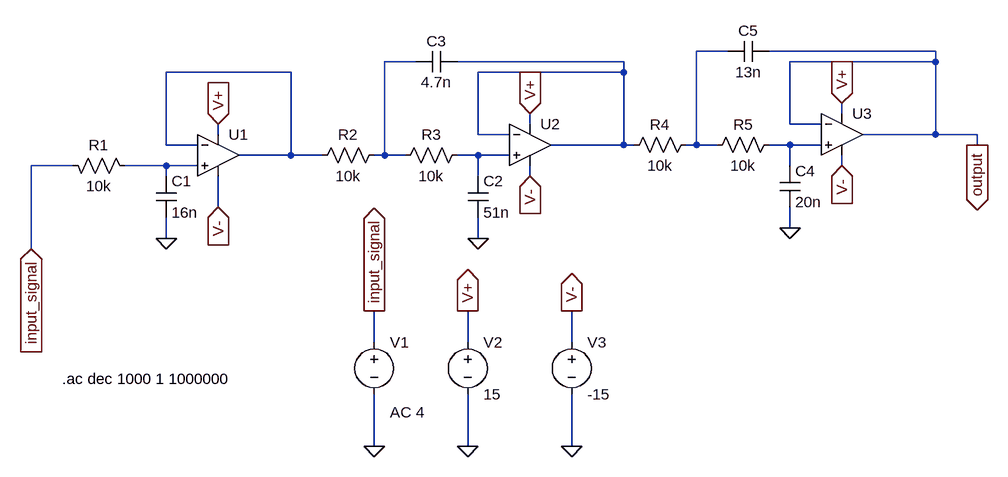
[diagram p0: schematic simulation.asc]
simulation.asc, the LTspice schematic file:
Version 4.1
SHEET 1 1496 680
WIRE 1040 -16 992 -16
WIRE 1360 -16 1104 -16
WIRE 560 0 512 0
WIRE 880 0 624 0
WIRE 1360 0 1360 -16
WIRE 1360 0 1136 0
WIRE 368 16 176 16
WIRE 880 16 880 0
WIRE 880 16 656 16
WIRE 1216 80 1216 64
WIRE 736 96 736 80
WIRE 1136 96 1136 0
WIRE 1184 96 1136 96
WIRE 256 112 256 96
WIRE 656 112 656 16
WIRE 704 112 656 112
WIRE 1360 112 1360 0
WIRE 1360 112 1248 112
WIRE 1424 112 1360 112
WIRE 176 128 176 16
WIRE 224 128 176 128
WIRE 880 128 880 16
WIRE 880 128 768 128
WIRE 896 128 880 128
WIRE 992 128 992 -16
WIRE 992 128 976 128
WIRE 1024 128 992 128
WIRE 1136 128 1104 128
WIRE 1184 128 1136 128
WIRE 1424 128 1424 112
WIRE 368 144 368 16
WIRE 368 144 288 144
WIRE 416 144 368 144
WIRE 512 144 512 0
WIRE 512 144 496 144
WIRE 544 144 512 144
WIRE 656 144 624 144
WIRE 704 144 656 144
WIRE 32 160 -32 160
WIRE 176 160 112 160
WIRE 224 160 176 160
WIRE 1136 160 1136 128
WIRE 1216 160 1216 144
WIRE 176 176 176 160
WIRE 656 176 656 144
WIRE 736 176 736 160
WIRE 256 224 256 176
WIRE 1136 256 1136 224
WIRE 176 272 176 240
WIRE 656 272 656 240
WIRE -32 288 -32 160
WIRE 496 432 496 384
WIRE 640 432 640 384
WIRE 800 432 800 384
WIRE 496 592 496 512
WIRE 640 592 640 512
WIRE 800 592 800 512
FLAG 176 272 0
FLAG 256 96 V+
IOPIN 256 96 In
FLAG 256 224 V-
IOPIN 256 224 In
FLAG 736 80 V+
IOPIN 736 80 In
FLAG 736 176 V-
IOPIN 736 176 In
FLAG 656 272 0
FLAG 1216 64 V+
IOPIN 1216 64 In
FLAG 1216 160 V-
IOPIN 1216 160 In
FLAG 1136 256 0
FLAG 496 592 0
FLAG 640 592 0
FLAG 800 592 0
FLAG 496 384 input_signal
IOPIN 496 384 Out
FLAG 640 384 V+
IOPIN 640 384 Out
FLAG 800 384 V-
IOPIN 800 384 Out
FLAG -32 288 input_signal
IOPIN -32 288 In
FLAG 1424 128 output
IOPIN 1424 128 Out
SYMBOL cap 160 176 R0
SYMATTR InstName C1
SYMATTR Value 16n
SYMBOL res 16 144 M90
WINDOW 0 0 56 VBottom 2
WINDOW 3 32 56 VTop 2
SYMATTR InstName R1
SYMATTR Value 10k
SYMBOL res 512 128 R90
WINDOW 0 0 56 VBottom 2
WINDOW 3 32 56 VTop 2
SYMATTR InstName R2
SYMATTR Value 10k
SYMBOL res 640 128 R90
WINDOW 0 0 56 VBottom 2
WINDOW 3 32 56 VTop 2
SYMATTR InstName R3
SYMATTR Value 10k
SYMBOL cap 640 176 R0
SYMATTR InstName C2
SYMATTR Value 51n
SYMBOL cap 624 -16 R90
WINDOW 0 0 32 VBottom 2
WINDOW 3 32 32 VTop 2
SYMATTR InstName C3
SYMATTR Value 4.7n
SYMBOL res 992 112 R90
WINDOW 0 0 56 VBottom 2
WINDOW 3 32 56 VTop 2
SYMATTR InstName R4
SYMATTR Value 10k
SYMBOL res 1120 112 R90
WINDOW 0 0 56 VBottom 2
WINDOW 3 32 56 VTop 2
SYMATTR InstName R5
SYMATTR Value 10k
SYMBOL cap 1120 160 R0
SYMATTR InstName C4
SYMATTR Value 20n
SYMBOL cap 1104 -32 R90
WINDOW 0 0 32 VBottom 2
WINDOW 3 32 32 VTop 2
SYMATTR InstName C5
SYMATTR Value 13n
SYMBOL voltage 496 416 R0
WINDOW 123 24 124 Left 2
WINDOW 39 0 0 Left 0
SYMATTR InstName V1
SYMATTR Value ""
SYMATTR Value2 AC 4
SYMBOL voltage 640 416 R0
WINDOW 123 0 0 Left 0
WINDOW 39 0 0 Left 0
SYMATTR InstName V2
SYMATTR Value 15
SYMBOL voltage 800 416 R0
WINDOW 123 0 0 Left 0
WINDOW 39 0 0 Left 0
SYMATTR InstName V3
SYMATTR Value -15
SYMBOL OpAmps\\UniversalOpAmp2 256 144 R0
SYMATTR InstName U1
SYMBOL OpAmps\\UniversalOpAmp2 736 128 R0
SYMATTR InstName U2
SYMBOL OpAmps\\UniversalOpAmp2 1216 112 R0
SYMATTR InstName U3
TEXT 16 488 Left 2 !.ac dec 1000 1 1000000

The netlist it stands for:
* simulation.asc
C1 N007 0 16n
R1 input_signal N007 10k
R2 N002 N004 10k
R3 N006 N002 10k
C2 N006 0 51n
C3 N003 N002 4.7n
R4 N001 N003 10k
R5 N005 N001 10k
C4 N005 0 20n
C5 output N001 13n
V1 input_signal 0 AC 4
V2 V+ 0 15
V3 V- 0 -15
X§U1 N007 N004 V+ V- N004 level2 Avol=1Meg GBW=10Meg Slew=10Meg Ilimit=25m Rail=0 Vos=0 En=0 Enk=0 In=0 Ink=0 Rin=500Meg  ; pins In+ In- V+ V- OUT
X§U2 N006 N003 V+ V- N003 level2 Avol=1Meg GBW=10Meg Slew=10Meg Ilimit=25m Rail=0 Vos=0 En=0 Enk=0 In=0 Ink=0 Rin=500Meg  ; pins In+ In- V+ V- OUT
X§U3 N005 output V+ V- output level2 Avol=1Meg GBW=10Meg Slew=10Meg Ilimit=25m Rail=0 Vos=0 En=0 Enk=0 In=0 Ink=0 Rin=500Meg  ; pins In+ In- V+ V- OUT
.ac dec 1000 1 1000000
.lib UniversalOpAmp2.lib
.backanno
.end